# Altium schematic sheet Connector.SchDoc
size A4; Organization: Altium Limited; Address1: L3, 12a Rodborough Rd; Address2: Frenchs Forest; Address3: NSW; Address4: Australia 2086
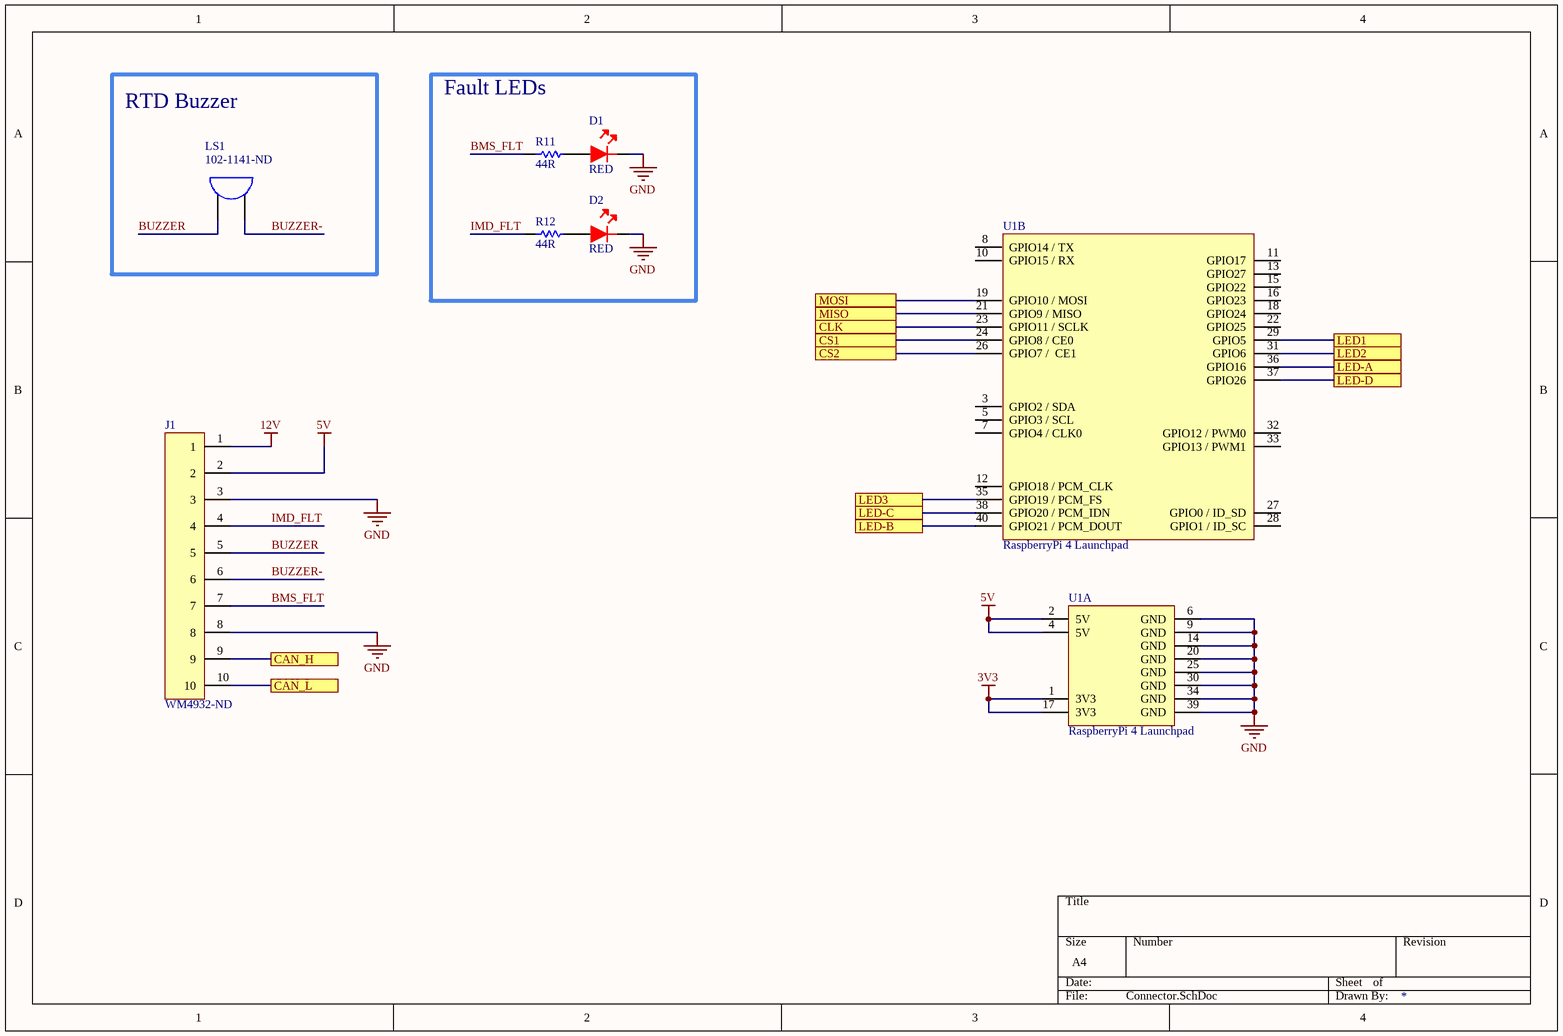
[diagram p0: Connector.SchDoc]

## Parts
D1  RED  [LED]
D2  RED  [LED]
J1  WM4932-ND  [10PIN]
LS1  102-1141-ND  [Buzzer]
R11  44R  [RES-0603]
R12  44R  [RES-0603]
U1  RaspberryPi 4 Launchpad  [Rpi Connector]  (parts A,B of 2)

## Blocks framed on the sheet
RTD Buzzer: LS1
Fault LEDs: D1 D2 R11 R12

## Ports
CAN_H, CAN_L, CLK, CS1, CS2, LED1, LED2, LED3, LED-A, LED-B, LED-C, LED-D, MISO, MOSI

## Nets
3V3: U1.1(3V3) U1.17(3V3)
5V: J1.2 U1.2(5V) U1.4(5V)
12V: J1.1
GND: D1.2 D2.2 J1.3 J1.8 U1.6(GND) U1.9(GND) U1.14(GND) U1.20(GND) U1.25(GND) U1.30(GND) U1.34(GND) U1.39(GND)
BMS_FLT: J1.7 R11.1
BUZZER: J1.5 LS1.1
BUZZER-: J1.6 LS1.2
CAN_H: J1.9 ; port CAN_H
CAN_L: J1.10 ; port CAN_L
CLK: U1.23(GPIO11_/_SCLK) ; port CLK
CS1: U1.24(GPIO8_/_CE0) ; port CS1
CS2: U1.26(GPIO7_/__CE1) ; port CS2
IMD_FLT: J1.4 R12.1
LED1: U1.29(GPIO5) ; port LED1
LED2: U1.31(GPIO6) ; port LED2
LED3: U1.35(GPIO19_/_PCM_FS) ; port LED3
LED-A: U1.36(GPIO16) ; port LED-A
LED-B: U1.40(GPIO21_/_PCM_DOUT) ; port LED-B
LED-C: U1.38(GPIO20_/_PCM_IDN) ; port LED-C
LED-D: U1.37(GPIO26) ; port LED-D
MISO: U1.21(GPIO9_/_MISO) ; port MISO
MOSI: U1.19(GPIO10_/_MOSI) ; port MOSI
NetD1_1: D1.1 R11.2
NetD2_1: D2.1 R12.2

Not connected (* = marked no-connect by the designer): U1 3(GPIO2_/_SDA) 5(GPIO3_/_SCL) 7(GPIO4_/_CLK0) 8(GPIO14_/_TX) 10(GPIO15_/_RX) 11(GPIO17) 12(GPIO18_/_PCM_CLK) 13(GPIO27) 15(GPIO22) 16(GPIO23) 18(GPIO24) 22(GPIO25) 27(GPIO0_/_ID_SD) 28(GPIO1_/_ID_SC) 32(GPIO12_/_PWM0) 33(GPIO13_/_PWM1)

## Notes on the sheet
- Title
- Size:
- Date:
- A4
- Number:
- Time:
- Revision:
- Sheet
- of
- File:

## Library data of the parts
D1 D2 = RED_LED: 2835 PLCC2 RED WLD: 620NM TYP. 1; Manufacturer: QT-Brightek; Manufacturer Part Number: QBHP686-RH; Lens Color: Colorless; Lens Style: Flat; Lens Transparency: Clear; Forward Voltage: 2.4V; Test Current: 150mA; Viewing Angle: 120°; Supplier 1: Digi-Key; Stock 1: 3207; Pricing 1: 1=0.85, 10=0.553, 100=0.3625, 1000=0.2862 (USD); Mount: Surface Mount; Case/Package: 1113; Color: Red; Case Code (Imperial): 1113; Packaging: Tape and Reel; Dominant Wavelength: 620nm; Length: 3.1mm; Width: 2.8mm; Height: 1mm; ComponentLink1URL: http://www.qt-brightek.com/datasheet/QBHP686-XXH Series.pdf?src-supplier=Digi-Key; ComponentLink1Description: http://www.qt-brightek.com/datasheet/QBHP686-XXH Series.pdf?src-supplier=Digi-Key; Supplier Part Number 1: 1516-1369-6-ND
J1 = 10PIN: CONN HEADER R/A 10POS 2.54MM; Manufacturer: Molex; Manufacturer Part Number: 0705530044; Number of Positions: 10; Gender: Male; Contact Resistance: 30mR; Connector Type: Male Pin; Supplier 1: Digi-Key; Stock 1: 1173; Pricing 1: 1=2.61, 10=2.367, 100=2.0288, 500=1.69068, 1000=1.44915, 5000=1.28491 (USD); Mount: Through Hole; Housing Material: Polyester; Housing Color: Black; Contact Plating: Tin; Contact Material: Bronze; Color: Black; Min Operating Temperature: -40°C; Max Operating Temperature: 105°C; Number of Rows: 1; Packaging: Rail/Tube; Termination: Solder; Orientation: Right Angle; Number of Contacts: 10; Length: 27.95mm; Pitch: 2.54mm; Depth: 13.59mm; Contact Mating Length: 0.24inch; ComponentLink1URL: http://www.molex.com/webdocs/datasheets/pdf/en-us/0705530044_PCB_HEADERS.pdf?src-supplier=Avnet; ComponentLink1Description: http://www.molex.com/webdocs/datasheets/pdf/en-us/0705530044_PCB_HEADERS.pdf?src-supplier=Avnet; Supplier Part Number 1: WM4932-ND
LS1 = Buzzer: AUDIO PIEZO TRANSDUCER 30V TH; Manufacturer: CUI; Voltage Rating: 10V; Operating Supply Current: 8mA; Self Resonant Frequency: 2kHz; Capacitance: 28nF; Washable: No; Supplier 1: Digi-Key; Manufacturer Part Number: CEP-1116; Stock 1: 11267; Pricing 1: 1=1.91, 10=1.588, 25=1.468, 50=1.3806, 100=1.2963, 500=1.11268, 1000=1.0621 (USD); Mount: Through Hole; Case/Package: Radial; Min Operating Temperature: -30°C; Max Operating Temperature: 85°C; Packaging: Bulk; Termination: PC Pins; Diameter: 30mm; Height: 10.5mm; Lead Free: Lead Free; Supplier Part Number 1: 102-1141-ND
R11 R12 = 0603-44R: Manufacturer: Panasonic; Manufacturer Part Number: ERJ-3EKF44R2V; Resistance: 44.2R; Tolerance: 1%; Power Rating: 100mW; Voltage Rating: 75V; Temperature Coefficient: 100ppm/°C; Voltage Rating (DC): 50V; Supplier 1: Digi-Key; Stock 1: 31052; Pricing 1: 1=0.1, 10=0.037, 100=0.0149, 1000=0.0067, 2500=0.00582 (USD); Mount: Surface Mount; Case/Package: 0603; Case Code (Imperial): 0603; Case Code (Metric): 1608; Weight: 7.1E-05oz; Contact Plating: Tin; Min Operating Temperature: -55°C; Max Operating Temperature: 155°C; Packaging: Tape and Reel; Package Quantity: 1; Resistor Type: Thick Film; Termination: SMD/SMT; Number of Terminations: 2; Max Power Dissipation: 100mW; Features: Automotive AEC-Q200; Series: ERJ; Resistance Tolerance: 1%; Construction: Rectangular; Length: 1.6mm; Width: 0.8mm; Height: 0.022inch; Depth: 0.8mm; REACH SVHC: No SVHC; Military Standard: Not; RoHS Compliant: Yes; ComponentLink1URL: http://industrial.panasonic.com/www-data/pdf/AOA0000/AOA0000CE2.pdf?src-supplier=Avnet; ComponentLink1Description: http://industrial.panasonic.com/www-data/pdf/AOA0000/AOA0000CE2.pdf?src-supplier=Avnet; ComponentLink2URL: http://industrial.panasonic.com/cdbs/www-data/pdf/RDA0000/AOA0000C304.pdf?src-supplier=Farnell; ComponentLink2Description: http://industrial.panasonic.com/cdbs/www-data/pdf/RDA0000/AOA0000C304.pdf?src-supplier=Farnell; ComponentLink3URL: http://www.farnell.com/datasheets/426256.pdf?src-supplier=Element14; ComponentLink3Description: http://www.farnell.com/datasheets/426256.pdf?src-supplier=Element14; Supplier Part Number 1: P44.2HDKR-ND
U1 = RasPi4: CONNECTOR DEV BOARD RaspberryPi 4; Manufacturer: Sullins; Manufacturer Part Number: PPPC202LFBN-RC; Number of Positions: 40; Connector Type: Header; Pitch: 0.1inch; Supplier 1: Digi-Key; Stock 1: 10499; Pricing 1: 1=2.38, 10=2.068, 80=1.84838, 440=1.54034, 1000=1.3203, 5000=1.1736 (USD); Mount: Through Hole; Color: Black; Contact Plating: Gold; Contact Material: Bronze; Housing Material: Plastic; Package Quantity: 1000; Number of Rows: 2; Packaging: Bulk; Termination: Solder; Contact Type: Female Socket; Length: 51.3mm; Width: 5mm; Height: 8.5mm; Row Spacing: 0.1inch; Lead Free: Lead Free; RoHS Compliant: Yes; Supplier Part Number 1: S7123-ND